# Altium schematic sheet headerP3_blk.SchDoc
size A4; Engineer: JBayalas; DocumentNumber: 7; Revision: V1.1; SheetNumber: 7; SheetTotal: 13
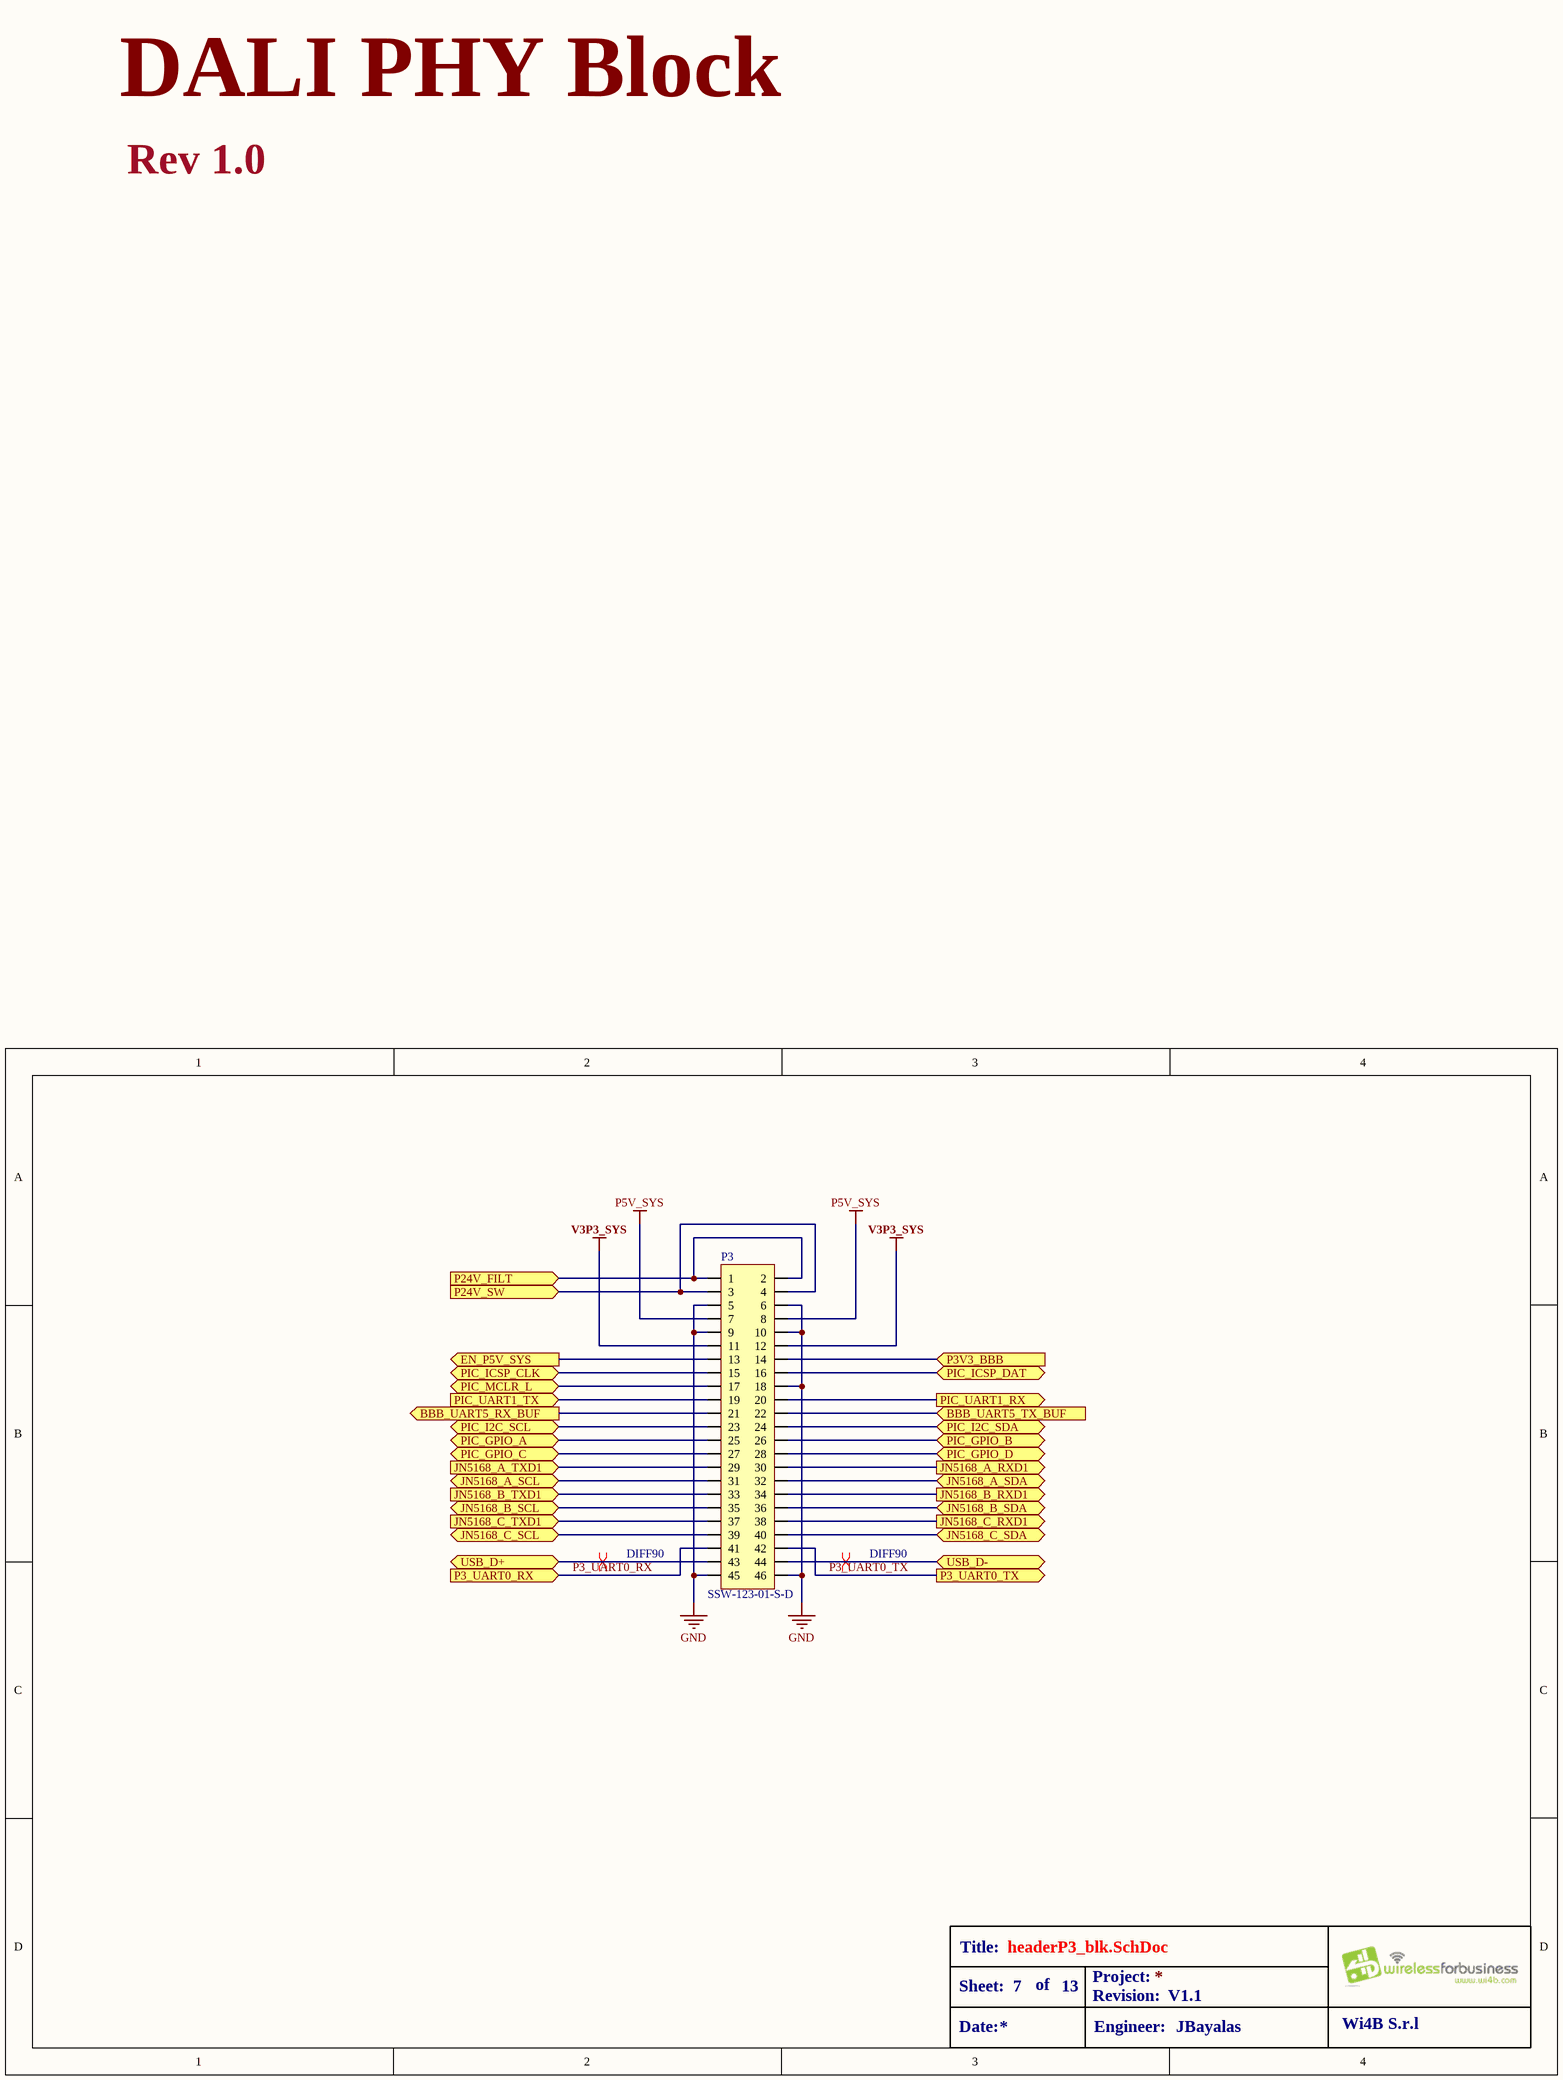
[diagram p0: headerP3_blk.SchDoc]

## Parts
P3  value SSW-123-01-S-D  [2x23 Header Female]  (hidden comment: *)

## Ports
BBB_UART5_RX_BUF (out), BBB_UART5_TX_BUF (in), EN_P5V_SYS (out), JN5168_A_RXD1 (out), JN5168_A_SCL, JN5168_A_SDA, JN5168_A_TXD1 (in), JN5168_B_RXD1 (out), JN5168_B_SCL, JN5168_B_SDA, JN5168_B_TXD1 (in), JN5168_C_RXD1 (out), JN5168_C_SCL, JN5168_C_SDA, JN5168_C_TXD1 (in), P3_UART0_RX (in), P3_UART0_TX (out), P3V3_BBB (in), P24V_FILT (in), P24V_SW (in), PIC_GPIO_A, PIC_GPIO_B, PIC_GPIO_C, PIC_GPIO_D, PIC_I2C_SCL, PIC_I2C_SDA, PIC_ICSP_CLK, PIC_ICSP_DAT, PIC_MCLR_L, PIC_UART1_RX (out), PIC_UART1_TX (in), USB_D+, USB_D-

## Nets
GND: P3.5 P3.6 P3.9 P3.10 P3.18 P3.45 P3.46
P5V_SYS: P3.7 P3.8
V3P3_SYS: P3.11 P3.12
BBB_UART5_RX_BUF: P3.21 ; port BBB_UART5_RX_BUF
BBB_UART5_TX_BUF: P3.22 ; port BBB_UART5_TX_BUF
EN_P5V_SYS: P3.13 ; port EN_P5V_SYS
JN5168_A_RXD1: P3.30 ; port JN5168_A_RXD1
JN5168_A_SCL: P3.31 ; port JN5168_A_SCL
JN5168_A_SDA: P3.32 ; port JN5168_A_SDA
JN5168_A_TXD1: P3.29 ; port JN5168_A_TXD1
JN5168_B_RXD1: P3.34 ; port JN5168_B_RXD1
JN5168_B_SCL: P3.35 ; port JN5168_B_SCL
JN5168_B_SDA: P3.36 ; port JN5168_B_SDA
JN5168_B_TXD1: P3.33 ; port JN5168_B_TXD1
JN5168_C_RXD1: P3.38 ; port JN5168_C_RXD1
JN5168_C_SCL: P3.39 ; port JN5168_C_SCL
JN5168_C_SDA: P3.40 ; port JN5168_C_SDA
JN5168_C_TXD1: P3.37 ; port JN5168_C_TXD1
P3_UART0_RX: P3.41 ; port P3_UART0_RX
P3_UART0_TX: P3.42 ; port P3_UART0_TX
P3V3_BBB: P3.14 ; port P3V3_BBB
P24V_FILT: P3.1 P3.2 ; port P24V_FILT
P24V_SW: P3.3 P3.4 ; port P24V_SW
PIC_GPIO_A: P3.25 ; port PIC_GPIO_A
PIC_GPIO_B: P3.26 ; port PIC_GPIO_B
PIC_GPIO_C: P3.27 ; port PIC_GPIO_C
PIC_GPIO_D: P3.28 ; port PIC_GPIO_D
PIC_I2C_SCL: P3.23 ; port PIC_I2C_SCL
PIC_I2C_SDA: P3.24 ; port PIC_I2C_SDA
PIC_ICSP_CLK: P3.15 ; port PIC_ICSP_CLK
PIC_ICSP_DAT: P3.16 ; port PIC_ICSP_DAT
PIC_MCLR_L: P3.17 ; port PIC_MCLR_L
PIC_UART1_RX: P3.20 ; port PIC_UART1_RX
PIC_UART1_TX: P3.19 ; port PIC_UART1_TX
USB_D+: P3.43 ; port USB_D+
USB_D-: P3.44 ; port USB_D-

## Layout directives
differential pair; net class DIFF90: USB_D+, USB_D-

## Notes on the sheet
- DALI PHY Block
- Rev 1.0
- Title:
- Sheet:
- Date:
- of
- Project:
- Revision:
- Engineer:
- Wi4B S.r.l

## Library data of the parts
P3 = SSW-123-01-S-D: CONN RCPT .100" 46POS DUAL GOLD; MFT: Samtec; FUNCTION: P3; MPN: SSW-123-01-S-D; RATING: *; TYPE: TH; LOAD: *